# Altium schematic sheet FusesControl.SchDoc
size A4
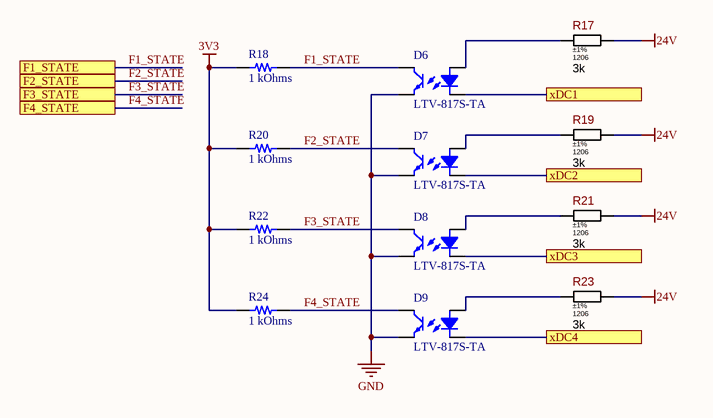
[diagram p0: FusesControl.SchDoc]

## Parts
D6  LTV-817S-TA  [LITEON LTV-817]
D7  LTV-817S-TA  [LITEON LTV-817]
D8  LTV-817S-TA  [LITEON LTV-817]
D9  LTV-817S-TA  [LITEON LTV-817]
R17  Tolerance: ±1%  Package: 1206  [R_ANY_CHIP_1206_MED]  (hidden comment: 3k)
R18  1 kOhms  [RES 0805_2012]
R19  Tolerance: ±1%  Package: 1206  [R_ANY_CHIP_1206_MED]  (hidden comment: 3k)
R20  1 kOhms  [RES 0805_2012]
R21  Tolerance: ±1%  Package: 1206  [R_ANY_CHIP_1206_MED]  (hidden comment: 3k)
R22  1 kOhms  [RES 0805_2012]
R23  Tolerance: ±1%  Package: 1206  [R_ANY_CHIP_1206_MED]  (hidden comment: 3k)
R24  1 kOhms  [RES 0805_2012]

## Ports
F1_STATE, F2_STATE, F3_STATE, F4_STATE, xDC1, xDC2, xDC3, xDC4

## Nets
3V3: R18.2 R20.2 R22.2 R24.2
24V: R17.2 R19.2 R21.2 R23.2
GND: D6.3 D7.3 D8.3 D9.3
F1_STATE: D6.4 R18.1 ; port F1_STATE
F2_STATE: D7.4 R20.1 ; port F2_STATE
F3_STATE: D8.4 R22.1 ; port F3_STATE
F4_STATE: D9.4 R24.1 ; port F4_STATE
xDC1: D6.2 ; port xDC1
xDC2: D7.2 ; port xDC2
xDC3: D8.2 ; port xDC3
xDC4: D9.2 ; port xDC4
NetD6_1: D6.1 R17.1
NetD7_1: D7.1 R19.1
NetD8_1: D8.1 R21.1
NetD9_1: D9.1 R23.1

## Library data of the parts
D6-D9 = LTV-817S-TA: OPTOISOLATR 5KV TRANSISTOR 4-SMD; Manufacturer: Lite-On Inc.; Current - DC Forward (If) (Max): 50mA; Current Transfer Ratio (Max): 600% @ 5mA; Current Transfer Ratio (Min): 50% @ 5mA; Input Type: DC; Number of Channels: 1; Rise / Fall Time (Typ): 4µs, 3µs; Vce Saturation (Max): 200mV; Voltage - Forward (Vf) (Typ): 1.2V; Voltage - Isolation: 5000Vrms; Voltage - Output (Max): 35V; Part Number: LTV-817S-TA; ComponentLink1Description: Datasheet; ComponentLink1URL: http://optoelectronics.liteon.com/upload/download/DS-70-96-0016/LTV-8X7%20series%20201610%20.pdf; ComponentLink2Description: DigiKey Link; ComponentLink2URL: http://digikey.com/product-detail/en/lite-on-inc/LTV-817S-TA/160-2038-1-ND/3711420; Current - Output / Channel: 50mA; Device Package: 4-SMD, Gull Wing; LastUpdated: 12.01.2020 21:59:02; Lifecycle Status: Active; Minimum Order: 1; Mounting Type: Surface Mount; Operating Temperature: -30°C ~ 110°C; Output Type: Transistor; Package / Case: 4-SMD, Gull Wing; Packaging: TapeAndReel; Part Status: Active; Price: 0.12; Series: -; Supplier 1: DigiKey; Supplier Part Number 1: 160-2038-1-ND; Supplier Device Package: 4-SMD
R17 R19 R21 R23 = RC1206FR-073KL: 3 kOhms ±1%, 1/4W 1206 Thick Film Resistor; Manufacturer: Yageo; Ajax_1C_PN: NONE; Power Rating: 0.25W; Voltage: 200V; Temperature Stability: ±100ppm/°C; Value: 3k; Part Number: RC1206FR-073KL; Component Type: SMD; Lifecycle: RND Only; Temperature Range: -55°C ~ 155°C; ComponentLink1URL: https://www.yageo.com/upload/media/product/productsearch/datasheet/rchip/PYu-RC_Group_51_RoHS_L_11.pdf; Supplier 1: Digi-Key; Supplier Part Number 1: 311-3.00KFRTR-ND; Replacement: NONE; ComponentLink1Description: Datasheet
R18 R20 R22 R24 = RNCS0805BKE1K00: RES 1K OHM 0.1% 1/10W 0805; Manufacturer: Stackpole Electronics Inc; Power (Watts): 0.1W, 1/10W; Temperature Coefficient: ±25ppm/°C; Part Number: RNCS0805BKE1K00; Value: 1 kOhms; ComponentLink1Description: Datasheet; ComponentLink1URL: https://www.seielect.com/catalog/sei-rncs_rnch.pdf; ComponentLink2Description: DigiKey Link; ComponentLink2URL: http://digikey.com/product-detail/en/stackpole-electronics-inc/RNCS0805BKE1K00/RNCS0805BKE1K00CT-ND/1800170; Composition: Thin Film; Device Package: 0805 (2012 Metric); Features: Anti-Corrosive, Automotive AEC-Q200, Moisture Resistant; Height - Seated (Max): 0.026" (0.65mm); LastUpdated: 02.09.2020 01:15:24; Lifecycle Status: Active; Minimum Order: 1; Number of Terminations: 2; Operating Temperature: -55°C ~ 155°C; Package / Case: 0805 (2012 Metric); Packaging: TapeAndReel; PartId: 27715; Part Status: Active; Price: 0.09; Ratings: AEC-Q200; Resistance: 1 kOhms; Series: RNCS; Size / Dimension: 0.079" L x 0.049" W (2.00mm x 1.25mm); Supplier 1: DigiKey; Supplier Part Number 1: RNCS0805BKE1K00CT-ND; Supplier Device Package: 0805; Tolerance: ±0.1%